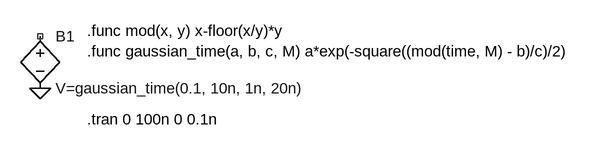
[diagram p0: schematic gaussian_pulses_bsource.asc]
gaussian_pulses_bsource.asc, the LTspice schematic file:
Version 4
SHEET 1 1048 680
FLAG 208 304 0
SYMBOL bv 208 208 R0
SYMATTR InstName B1
SYMATTR Value V=gaussian_time(0.1, 10n, 1n, 20n)
TEXT 280 352 Left 2 !.tran 0 100n 0 0.1n
TEXT 280 216 Left 2 !.func mod(x, y) x-floor(x/y)*y\n.func gaussian_time(a, b, c, M) a*exp(-square((mod(time, M) - b)/c)/2)

The netlist it stands for:
* gaussian_pulses_bsource.asc
B1 NC_01 0 V=gaussian_time(0.1, 10n, 1n, 20n)
.tran 0 100n 0 0.1n
.func mod(x, y) x-floor(x/y)*y
.func gaussian_time(a, b, c, M) a*exp(-square((mod(time, M) - b)/c)/2)
.backanno
.end